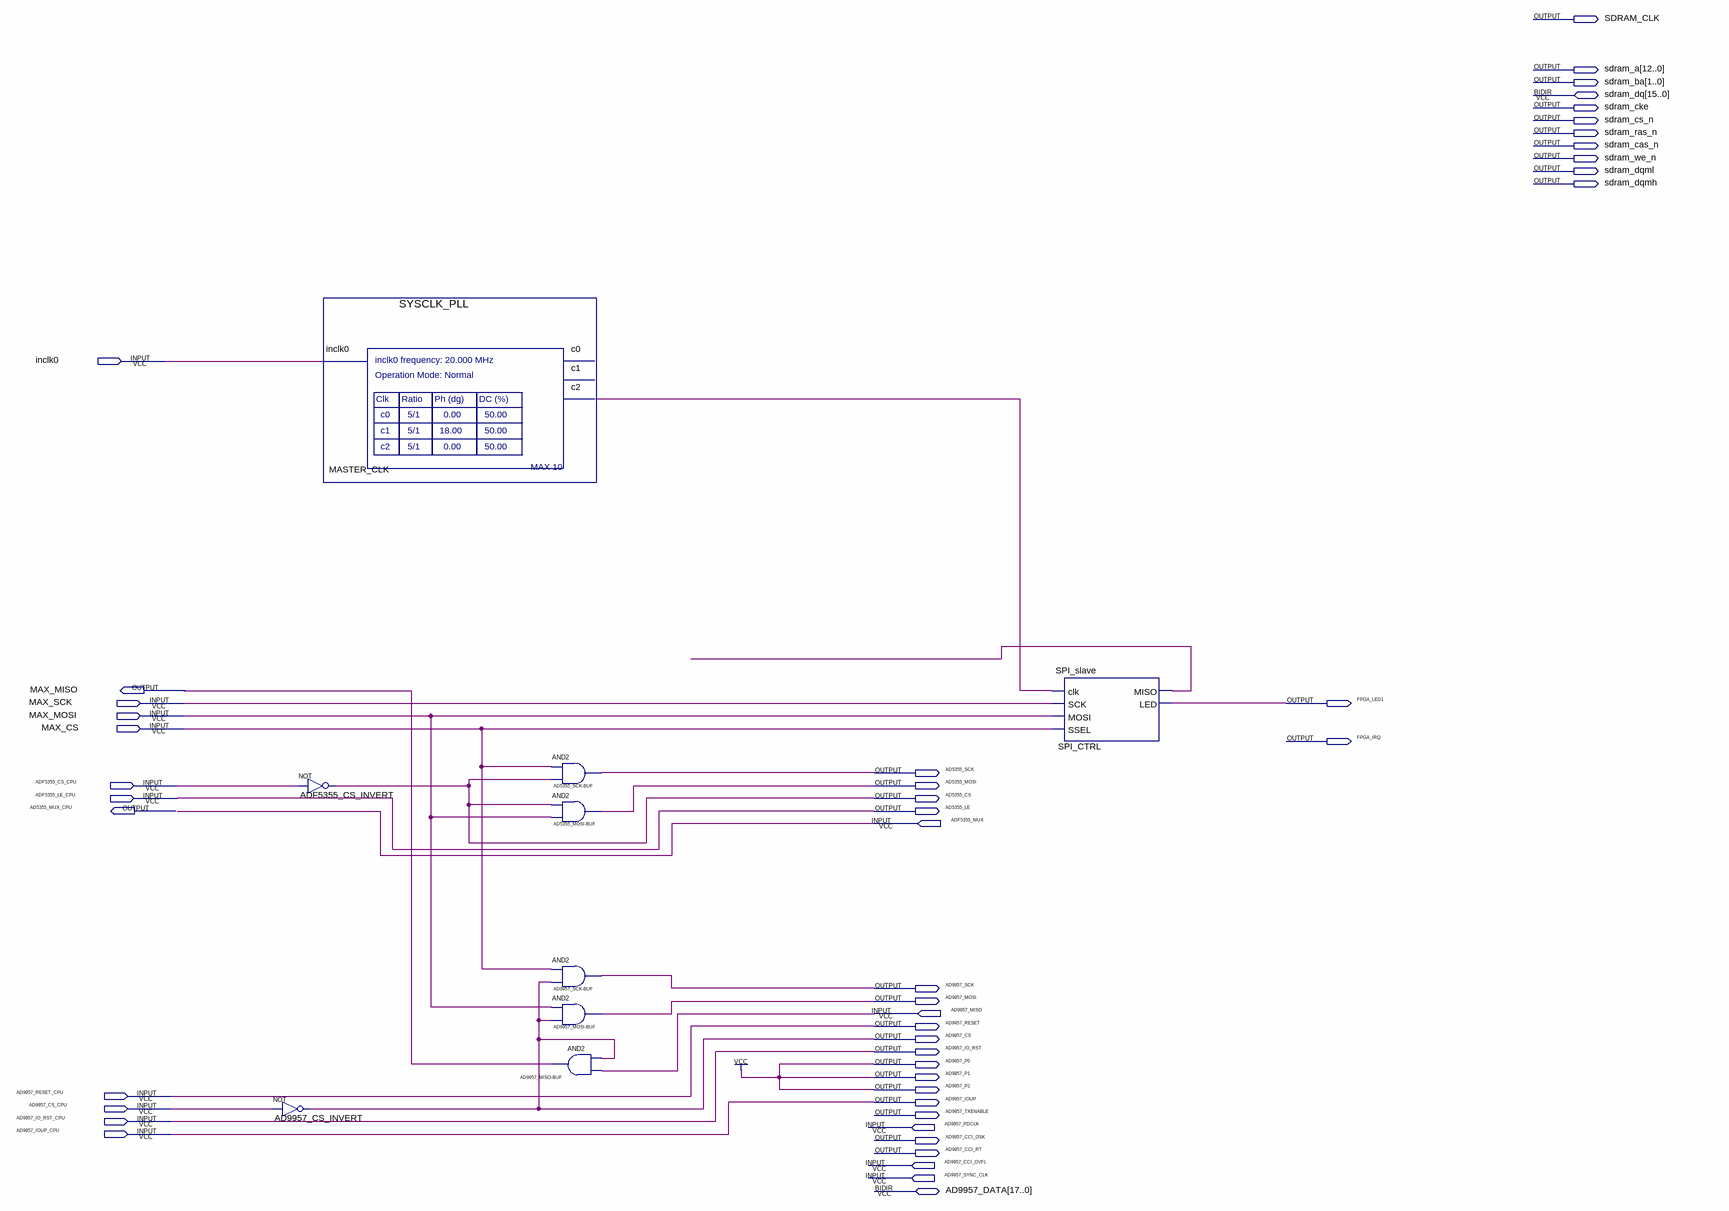
[diagram p0: schematic sheet]
// Quartus schematic FPGA_CTRL_01.bdf as structural Verilog: 9 symbols, 47 pins
module FPGA_CTRL_01 (
  input  inclk0,
  input  MAX_SCK,
  input  MAX_MOSI,
  input  MAX_CS,
  input  ADF5355_CS_CPU,
  input  ADF5355_LE_CPU,
  input  ADF5355_MUX,
  input  AD9957_MISO,
  input  AD9957_RESET_CPU,
  input  AD9957_CS_CPU,
  input  AD9957_IO_RST_CPU,
  input  AD9957_PDCLK,
  input  AD9957_IOUP_CPU,
  input  AD9957_CCI_OVFL,
  input  AD9957_SYNC_CLK,
  inout  [15:0] sdram_dq,
  inout  [17:0] AD9957_DATA,
  output SDRAM_CLK,
  output [12:0] sdram_a,
  output [1:0] sdram_ba,
  output sdram_cke,
  output sdram_cs_n,
  output sdram_ras_n,
  output sdram_cas_n,
  output sdram_we_n,
  output sdram_dqml,
  output sdram_dqmh,
  output MAX_MISO,
  output FPGA_LED1,
  output FPGA_IRQ,
  output AD5355_SCK,
  output AD5355_MOSI,
  output AD5355_CS,
  output AD5355_MUX_CPU,
  output AD5355_LE,
  output AD9957_SCK,
  output AD9957_MOSI,
  output AD9957_RESET,
  output AD9957_CS,
  output AD9957_IO_RST,
  output AD9957_P0,
  output AD9957_P1,
  output AD9957_P2,
  output AD9957_IOUP,
  output AD9957_TXENABLE,
  output AD9957_CCI_OSK,
  output AD9957_CCI_RT
);

  wire MASTER_CLK_c2, SPI_CTRL_miso;

  not AD9957_CS_INVERT (AD9957_CS, AD9957_CS_CPU);
  SYSCLK_PLL MASTER_CLK (.inclk0(inclk0), .c2(MASTER_CLK_c2));  // open: c0, c1
  not ADF5355_CS_INVERT (AD5355_CS, ADF5355_CS_CPU);
  and \AD5355_SCK-BUF  (AD5355_SCK, MAX_CS, AD5355_CS);
  and \AD5355_MOSI-BUF  (AD5355_MOSI, AD5355_CS, MAX_MOSI);
  and \AD9957_SCK-BUF  (AD9957_SCK, MAX_CS, AD9957_CS);
  and \AD9957_MOSI-BUF  (AD9957_MOSI, MAX_MOSI, AD9957_CS);
  and \AD9957_MISO-BUF  (MAX_MISO, AD9957_CS, AD9957_MISO);
  SPI_slave SPI_CTRL (
    .clk(MASTER_CLK_c2), .SCK(MAX_SCK), .MOSI(MAX_MOSI), .SSEL(MAX_CS), .MISO(SPI_CTRL_miso), .LED(FPGA_LED1));

  assign AD5355_LE = ADF5355_LE_CPU;
  assign AD5355_MUX_CPU = ADF5355_MUX;
  assign AD9957_IO_RST = AD9957_IO_RST_CPU;
  assign AD9957_IOUP = AD9957_IOUP_CPU;
  assign AD9957_P0 = 1'b1;
  assign AD9957_P1 = 1'b1;
  assign AD9957_P2 = 1'b1;
  assign AD9957_RESET = AD9957_RESET_CPU;
endmodule
